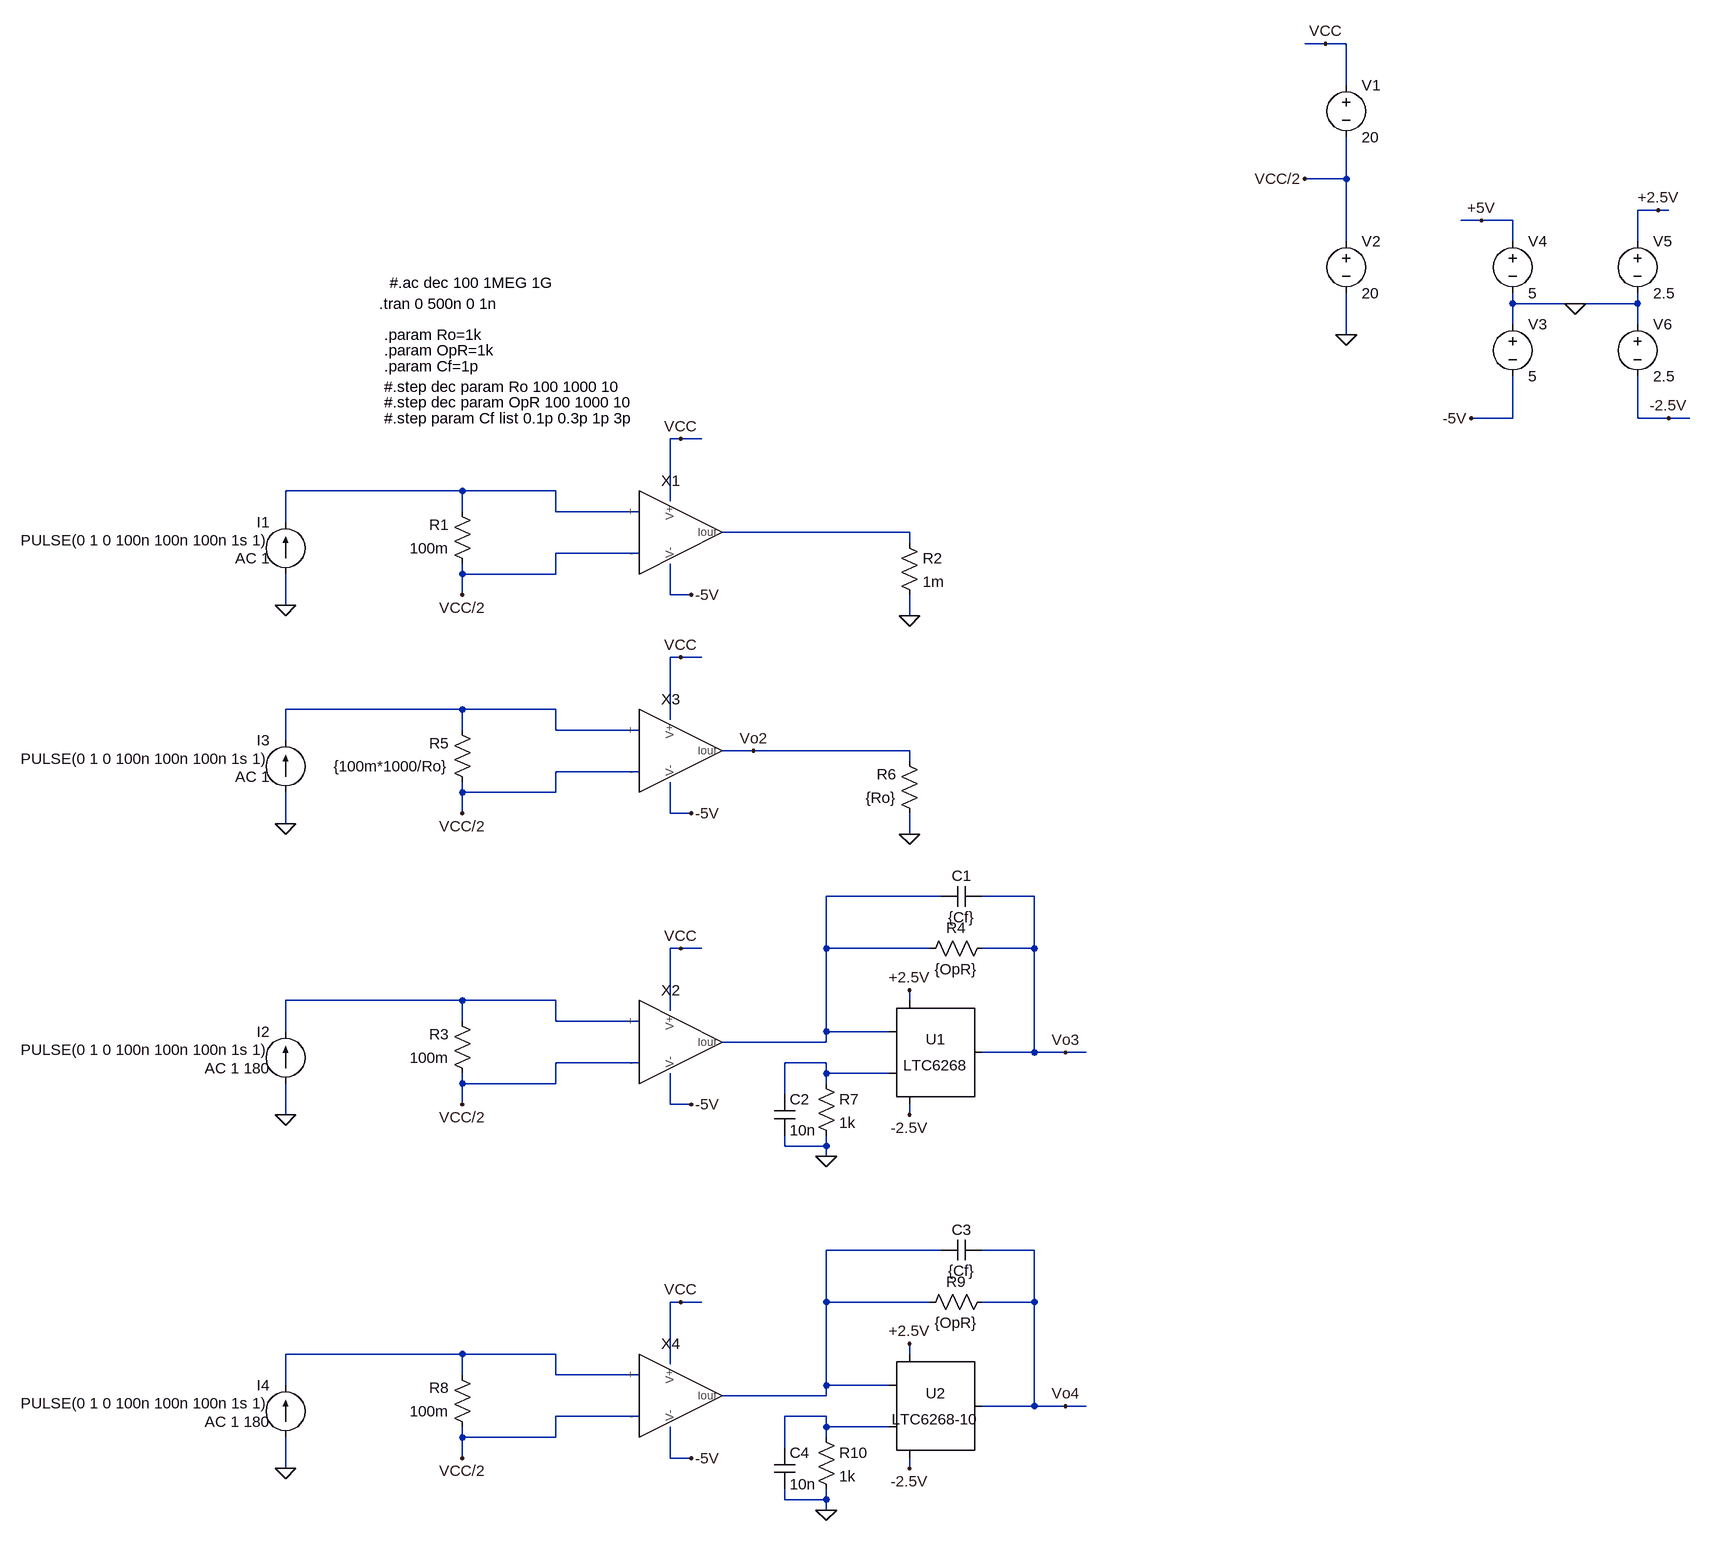
[diagram p0: schematic current-amp-test-circuit.asc]
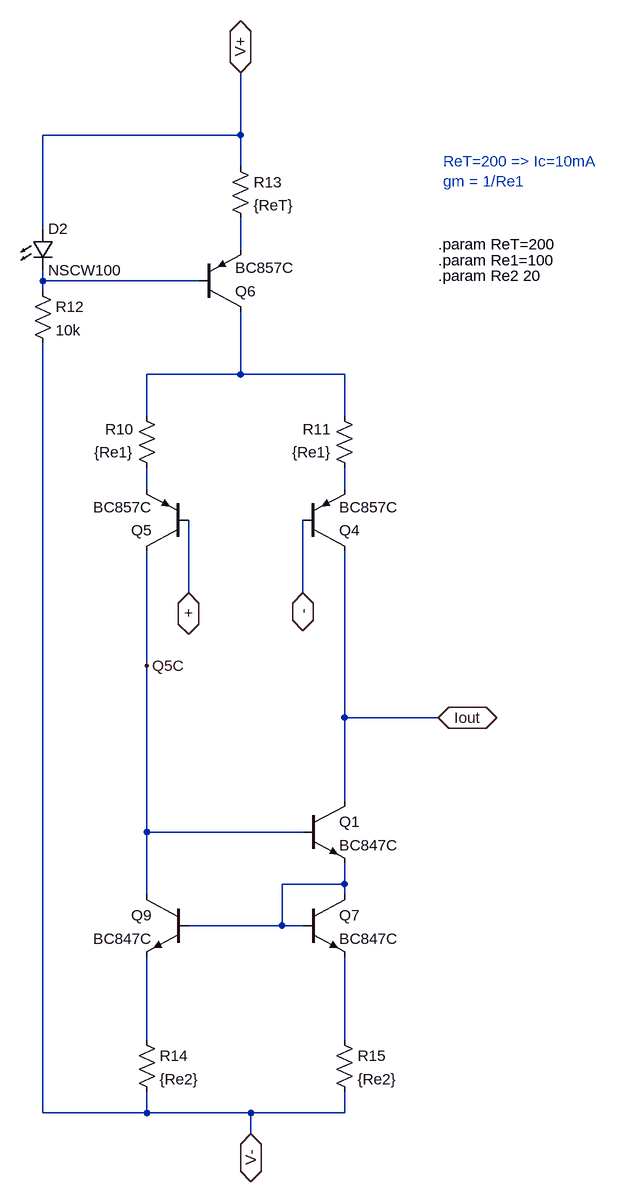
[diagram p1: sub-circuit current-amp.asc]
current-amp-test-circuit.asc, the LTspice schematic file:
Version 4
SHEET 1 1648 1724
WIRE 1072 -576 1040 -576
WIRE 1104 -576 1072 -576
WIRE 1104 -512 1104 -576
WIRE 1104 -368 1104 -432
WIRE 1104 -368 1040 -368
WIRE 1584 -320 1552 -320
WIRE 1600 -320 1584 -320
WIRE 1312 -304 1280 -304
WIRE 1360 -304 1312 -304
WIRE 1104 -272 1104 -368
WIRE 1360 -272 1360 -304
WIRE 1552 -272 1552 -320
WIRE 1360 -176 1360 -192
WIRE 1456 -176 1360 -176
WIRE 1552 -176 1552 -192
WIRE 1552 -176 1456 -176
WIRE 1360 -144 1360 -176
WIRE 1552 -144 1552 -176
WIRE 1104 -128 1104 -192
WIRE 1360 0 1360 -64
WIRE 1360 0 1296 0
WIRE 1552 0 1552 -64
WIRE 1600 0 1552 0
WIRE 1632 0 1600 0
WIRE 80 32 64 32
WIRE 112 32 80 32
WIRE -256 112 -528 112
WIRE -112 112 -256 112
WIRE 64 128 64 32
WIRE -256 144 -256 112
WIRE -112 144 -112 112
WIRE 16 144 -112 144
WIRE -528 160 -528 112
WIRE 432 176 144 176
WIRE 432 192 432 176
WIRE 16 208 -112 208
WIRE -256 240 -256 224
WIRE -112 240 -112 208
WIRE -112 240 -256 240
WIRE -256 272 -256 240
WIRE 64 272 64 224
WIRE 96 272 64 272
WIRE -528 288 -528 240
WIRE 432 304 432 272
WIRE 80 368 64 368
WIRE 112 368 80 368
WIRE -256 448 -528 448
WIRE -112 448 -256 448
WIRE 64 464 64 368
WIRE -256 480 -256 448
WIRE -112 480 -112 448
WIRE 16 480 -112 480
WIRE -528 496 -528 448
WIRE 192 512 144 512
WIRE 432 512 192 512
WIRE 432 528 432 512
WIRE 16 544 -112 544
WIRE -256 576 -256 560
WIRE -112 576 -112 544
WIRE -112 576 -256 576
WIRE -256 608 -256 576
WIRE 64 608 64 560
WIRE 96 608 64 608
WIRE -528 624 -528 576
WIRE 432 640 432 608
WIRE 480 736 304 736
WIRE 624 736 544 736
WIRE 80 816 64 816
WIRE 112 816 80 816
WIRE 304 816 304 736
WIRE 464 816 304 816
WIRE 624 816 624 736
WIRE 624 816 544 816
WIRE -256 896 -528 896
WIRE -112 896 -256 896
WIRE 432 896 432 880
WIRE 64 912 64 816
WIRE -256 928 -256 896
WIRE -112 928 -112 896
WIRE 16 928 -112 928
WIRE -528 944 -528 896
WIRE 304 944 304 816
WIRE 400 944 304 944
WIRE 304 960 304 944
WIRE 304 960 144 960
WIRE 624 976 624 816
WIRE 624 976 544 976
WIRE 672 976 624 976
WIRE 704 976 672 976
WIRE 16 992 -112 992
WIRE 304 992 240 992
WIRE 304 1008 304 992
WIRE 400 1008 304 1008
WIRE -256 1024 -256 1008
WIRE -112 1024 -112 992
WIRE -112 1024 -256 1024
WIRE 304 1024 304 1008
WIRE 240 1040 240 992
WIRE -256 1056 -256 1024
WIRE 64 1056 64 1008
WIRE 96 1056 64 1056
WIRE -528 1072 -528 1024
WIRE 432 1072 432 1056
WIRE 240 1120 240 1104
WIRE 304 1120 304 1104
WIRE 304 1120 240 1120
WIRE 304 1136 304 1120
WIRE 480 1280 304 1280
WIRE 624 1280 544 1280
WIRE 80 1360 64 1360
WIRE 112 1360 80 1360
WIRE 304 1360 304 1280
WIRE 464 1360 304 1360
WIRE 624 1360 624 1280
WIRE 624 1360 544 1360
WIRE -256 1440 -528 1440
WIRE -112 1440 -256 1440
WIRE 432 1440 432 1424
WIRE 64 1456 64 1360
WIRE -256 1472 -256 1440
WIRE -112 1472 -112 1440
WIRE 16 1472 -112 1472
WIRE -528 1488 -528 1440
WIRE 304 1488 304 1360
WIRE 400 1488 304 1488
WIRE 304 1504 304 1488
WIRE 304 1504 144 1504
WIRE 624 1520 624 1360
WIRE 624 1520 544 1520
WIRE 672 1520 624 1520
WIRE 704 1520 672 1520
WIRE 16 1536 -112 1536
WIRE 304 1536 240 1536
WIRE 304 1552 304 1536
WIRE 400 1552 304 1552
WIRE -256 1568 -256 1552
WIRE -112 1568 -112 1536
WIRE -112 1568 -256 1568
WIRE 304 1568 304 1552
WIRE 240 1584 240 1536
WIRE -256 1600 -256 1568
WIRE 64 1600 64 1552
WIRE 96 1600 64 1600
WIRE -528 1616 -528 1568
WIRE 432 1616 432 1600
WIRE 240 1664 240 1648
WIRE 304 1664 304 1648
WIRE 304 1664 240 1664
WIRE 304 1680 304 1664
FLAG 1104 -128 0
FLAG -528 288 0
FLAG 1072 -576 VCC
FLAG 1040 -368 VCC/2
FLAG 1296 0 -5V
FLAG 96 272 -5V
FLAG 80 32 VCC
FLAG 432 304 0
FLAG -256 272 VCC/2
FLAG -528 1072 0
FLAG 96 1056 -5V
FLAG 80 816 VCC
FLAG -256 1056 VCC/2
FLAG 1456 -176 0
FLAG 1312 -304 +5V
FLAG -528 624 0
FLAG 192 512 Vo2
FLAG 96 608 -5V
FLAG 80 368 VCC
FLAG 432 640 0
FLAG -256 608 VCC/2
FLAG 304 1136 0
FLAG 672 976 Vo3
FLAG 1584 -320 +2.5V
FLAG 1600 0 -2.5V
FLAG 432 880 +2.5V
FLAG 432 1072 -2.5V
FLAG -528 1616 0
FLAG 96 1600 -5V
FLAG 80 1360 VCC
FLAG -256 1600 VCC/2
FLAG 304 1680 0
FLAG 672 1520 Vo4
FLAG 432 1424 +2.5V
FLAG 432 1616 -2.5V
DATAFLAG 304 176 ""
DATAFLAG -448 112 ""
DATAFLAG -448 896 ""
DATAFLAG 304 512 ""
DATAFLAG -448 448 ""
DATAFLAG 640 976 ""
DATAFLAG -448 1440 ""
SYMBOL current-amp 64 192 R0
WINDOW 39 1 -52 Left 2
SYMATTR InstName X1
SYMBOL res -240 240 R180
WINDOW 0 36 76 Left 2
WINDOW 3 36 40 Left 2
SYMATTR InstName R1
SYMATTR Value 100m
SYMBOL res 416 176 R0
SYMATTR InstName R2
SYMATTR Value 1m
SYMBOL voltage 1104 -528 R0
WINDOW 123 0 0 Left 0
WINDOW 39 0 0 Left 0
SYMATTR InstName V1
SYMATTR Value 20
SYMBOL voltage 1104 -288 R0
WINDOW 123 0 0 Left 0
WINDOW 39 0 0 Left 0
SYMATTR InstName V2
SYMATTR Value 20
SYMBOL voltage 1360 -160 R0
WINDOW 123 0 0 Left 0
WINDOW 39 0 0 Left 0
SYMATTR InstName V3
SYMATTR Value 5
SYMBOL current -528 240 R180
WINDOW 0 24 80 Left 2
WINDOW 3 24 52 Left 2
WINDOW 123 24 24 Left 2
WINDOW 39 0 0 Left 0
SYMATTR InstName I1
SYMATTR Value PULSE(0 1 0 100n 100n 100n 1s 1)
SYMATTR Value2 AC 1
SYMBOL current-amp 64 976 R0
SYMATTR InstName X2
SYMBOL res -240 1024 R180
WINDOW 0 36 76 Left 2
WINDOW 3 36 40 Left 2
SYMATTR InstName R3
SYMATTR Value 100m
SYMBOL current -528 1024 R180
WINDOW 0 24 80 Left 2
WINDOW 3 24 52 Left 2
WINDOW 123 24 24 Left 2
WINDOW 39 0 0 Left 0
SYMATTR InstName I2
SYMATTR Value PULSE(0 1 0 100n 100n 100n 1s 1)
SYMATTR Value2 AC 1 180
SYMBOL voltage 1360 -288 R0
WINDOW 123 0 0 Left 0
WINDOW 39 0 0 Left 0
SYMATTR InstName V4
SYMATTR Value 5
SYMBOL current-amp 64 528 R0
SYMATTR InstName X3
SYMBOL res -240 576 R180
WINDOW 0 36 76 Left 2
WINDOW 3 36 40 Left 2
SYMATTR InstName R5
SYMATTR Value {100m*1000/Ro}
SYMBOL res 448 624 R180
WINDOW 0 36 76 Left 2
WINDOW 3 36 40 Left 2
SYMATTR InstName R6
SYMATTR Value {Ro}
SYMBOL current -528 576 R180
WINDOW 0 24 80 Left 2
WINDOW 3 24 52 Left 2
WINDOW 123 24 24 Left 2
WINDOW 39 0 0 Left 0
SYMATTR InstName I3
SYMATTR Value PULSE(0 1 0 100n 100n 100n 1s 1)
SYMATTR Value2 AC 1
SYMBOL res 560 800 R90
WINDOW 0 0 56 VBottom 2
WINDOW 3 32 56 VTop 2
SYMATTR InstName R4
SYMATTR Value {OpR}
SYMBOL res 288 1008 R0
SYMATTR InstName R7
SYMATTR Value 1k
SYMBOL cap 544 720 R90
WINDOW 0 0 32 VBottom 2
WINDOW 3 32 32 VTop 2
SYMATTR InstName C1
SYMATTR Value {Cf}
SYMBOL cap 224 1040 R0
SYMATTR InstName C2
SYMATTR Value 10n
SYMBOL voltage 1552 -288 R0
WINDOW 123 0 0 Left 0
WINDOW 39 0 0 Left 0
SYMATTR InstName V5
SYMATTR Value 2.5
SYMBOL voltage 1552 -160 R0
WINDOW 123 0 0 Left 0
WINDOW 39 0 0 Left 0
SYMATTR InstName V6
SYMATTR Value 2.5
SYMBOL OpAmps\\LTC6268 432 976 R0
SYMATTR InstName U1
SYMBOL current-amp 64 1520 R0
SYMATTR InstName X4
SYMBOL res -240 1568 R180
WINDOW 0 36 76 Left 2
WINDOW 3 36 40 Left 2
SYMATTR InstName R8
SYMATTR Value 100m
SYMBOL current -528 1568 R180
WINDOW 0 24 80 Left 2
WINDOW 3 24 52 Left 2
WINDOW 123 24 24 Left 2
WINDOW 39 0 0 Left 0
SYMATTR InstName I4
SYMATTR Value PULSE(0 1 0 100n 100n 100n 1s 1)
SYMATTR Value2 AC 1 180
SYMBOL res 560 1344 R90
WINDOW 0 0 56 VBottom 2
WINDOW 3 32 56 VTop 2
SYMATTR InstName R9
SYMATTR Value {OpR}
SYMBOL res 288 1552 R0
SYMATTR InstName R10
SYMATTR Value 1k
SYMBOL cap 544 1264 R90
WINDOW 0 0 32 VBottom 2
WINDOW 3 32 32 VTop 2
SYMATTR InstName C3
SYMATTR Value {Cf}
SYMBOL cap 224 1584 R0
SYMATTR InstName C4
SYMATTR Value 10n
SYMBOL OpAmps\\LTC6268-10 432 1520 R0
SYMATTR InstName U2
TEXT -384 -176 Left 2 !.tran 0 500n 0 1n
TEXT -368 -208 Left 2 !#.ac dec 100 1MEG 1G
TEXT -376 -128 Left 2 !.param Ro=1k
TEXT -376 -48 Left 2 !#.step dec param Ro 100 1000 10
TEXT -376 -104 Left 2 !.param OpR=1k
TEXT -376 -24 Left 2 !#.step dec param OpR 100 1000 10
TEXT -376 -80 Left 2 !.param Cf=1p
TEXT -376 0 Left 2 !#.step param Cf list 0.1p 0.3p 1p 3p

current-amp.asc, the sub-circuit schematic file:
Version 4
SHEET 1 1708 680
WIRE -1216 -1312 -1216 -1408
WIRE -1216 -1312 -1520 -1312
WIRE -1216 -1264 -1216 -1312
WIRE -1520 -1168 -1520 -1312
WIRE -1216 -1136 -1216 -1184
WIRE -1520 -1088 -1520 -1104
WIRE -1280 -1088 -1520 -1088
WIRE -1520 -1072 -1520 -1088
WIRE -1216 -944 -1216 -1040
WIRE -1216 -944 -1360 -944
WIRE -1056 -944 -1216 -944
WIRE -1360 -880 -1360 -944
WIRE -1056 -880 -1056 -944
WIRE -1360 -768 -1360 -800
WIRE -1056 -768 -1056 -800
WIRE -1296 -608 -1296 -720
WIRE -1120 -608 -1120 -720
WIRE -1360 -496 -1360 -672
WIRE -1056 -416 -1056 -672
WIRE -912 -416 -1056 -416
WIRE -1056 -288 -1056 -416
WIRE -1360 -240 -1360 -496
WIRE -1120 -240 -1360 -240
WIRE -1056 -160 -1056 -192
WIRE -1056 -160 -1152 -160
WIRE -1360 -144 -1360 -240
WIRE -1056 -144 -1056 -160
WIRE -1152 -96 -1152 -160
WIRE -1152 -96 -1296 -96
WIRE -1120 -96 -1152 -96
WIRE -1360 80 -1360 -48
WIRE -1056 80 -1056 -48
WIRE -1520 192 -1520 -992
WIRE -1360 192 -1360 160
WIRE -1360 192 -1520 192
WIRE -1200 192 -1360 192
WIRE -1056 192 -1056 160
WIRE -1056 192 -1200 192
WIRE -1200 224 -1200 192
FLAG -1360 -496 Q5C
FLAG -1216 -1408 V+
IOPIN -1216 -1408 BiDir
FLAG -1200 224 V-
IOPIN -1200 224 BiDir
FLAG -912 -416 Iout
IOPIN -912 -416 BiDir
FLAG -1296 -608 +
IOPIN -1296 -608 BiDir
FLAG -1120 -608 -
IOPIN -1120 -608 BiDir
DATAFLAG -1360 -336 "Ic(Q5)"
DATAFLAG -1056 -496 "Ic(Q4)"
DATAFLAG -1360 -784 "I(R10)"
DATAFLAG -1056 -160 ""
DATAFLAG -1168 192 ""
SYMBOL pnp -1120 -672 M180
SYMATTR InstName Q4
SYMATTR Value BC857C
SYMBOL pnp -1296 -672 R180
SYMATTR InstName Q5
SYMATTR Value BC857C
SYMBOL res -1344 -784 R180
WINDOW 0 36 76 Left 2
WINDOW 3 36 40 Left 2
SYMATTR InstName R10
SYMATTR Value {Re1}
SYMBOL res -1040 -784 R180
WINDOW 0 36 76 Left 2
WINDOW 3 36 40 Left 2
SYMATTR InstName R11
SYMATTR Value {Re1}
SYMBOL pnp -1280 -1040 M180
SYMATTR InstName Q6
SYMATTR Value BC857C
SYMBOL LED -1536 -1168 R0
SYMATTR InstName D2
SYMATTR Value NSCW100
SYMATTR Description Diode
SYMATTR Type diode
SYMBOL res -1536 -1088 R0
SYMATTR InstName R12
SYMATTR Value 10k
SYMBOL res -1232 -1280 R0
SYMATTR InstName R13
SYMATTR Value {ReT}
SYMBOL res -1376 64 R0
SYMATTR InstName R14
SYMATTR Value {Re2}
SYMBOL res -1072 64 R0
SYMATTR InstName R15
SYMATTR Value {Re2}
SYMBOL npn -1120 -144 R0
SYMATTR InstName Q7
SYMATTR Value BC847C
SYMBOL npn -1296 -144 M0
SYMATTR InstName Q9
SYMATTR Value BC847C
SYMBOL npn -1120 -288 R0
SYMATTR InstName Q1
SYMATTR Value BC847C
TEXT -912 -1144 Left 2 !.param ReT=200
TEXT -912 -1120 Left 2 !.param Re1=100
TEXT -912 -1096 Left 2 !.param Re2 20
TEXT -904 -1272 Left 2 ;ReT=200 => Ic=10mA\ngm = 1/Re1

The netlist it stands for:
* current-amp-test-circuit.asc
XX1 N001 VCC/2 N002 VCC -5V current-amp
R1 VCC/2 N001 100m
R2 N002 0 1m
V1 VCC VCC/2 20
V2 VCC/2 0 20
V3 0 -5V 5
I1 0 N001 PULSE(0 1 0 100n 100n 100n 1s 1) AC 1
XX2 N005 VCC/2 N004 VCC -5V current-amp
R3 VCC/2 N005 100m
I2 0 N005 PULSE(0 1 0 100n 100n 100n 1s 1) AC 1 180
V4 +5V 0 5
XX3 N003 VCC/2 Vo2 VCC -5V current-amp
R5 VCC/2 N003 {100m*1000/Ro}
R6 0 Vo2 {Ro}
I3 0 N003 PULSE(0 1 0 100n 100n 100n 1s 1) AC 1
R4 Vo3 N004 {OpR}
R7 N006 0 1k
C1 Vo3 N004 {Cf}
C2 N006 0 10n
V5 +2.5V 0 2.5
V6 0 -2.5V 2.5
XU1 N006 N004 Vo3 +2.5V -2.5V NC_01 LTC6268
XX4 N008 VCC/2 N007 VCC -5V current-amp
R8 VCC/2 N008 100m
I4 0 N008 PULSE(0 1 0 100n 100n 100n 1s 1) AC 1 180
R9 Vo4 N007 {OpR}
R10 N009 0 1k
C3 Vo4 N007 {Cf}
C4 N009 0 10n
XU2 N009 N007 Vo4 +2.5V -2.5V NC_02 LTC6268-10

* block symbol definitions
.subckt current-amp + - Iout V+ V-
Q4 Iout - N005 0 BC857C
Q5 Q5C + N004 0 BC857C
R10 N004 N003 {Re1}
R11 N005 N003 {Re1}
Q6 N003 N002 N001 0 BC857C
D2 V+ N002 NSCW100
R12 N002 V- 10k
R13 V+ N001 {ReT}
R14 N007 V- {Re2}
R15 N008 V- {Re2}
Q7 N006 N006 N008 0 BC847C
Q9 Q5C N006 N007 0 BC847C
Q1 Iout Q5C N006 0 BC847C
.param ReT=200
.param Re1=100
.param Re2 20
* ReT=200 => Ic=10mA
* gm = 1/Re1
.ends current-amp

.model D D
.lib standard.dio
.model NPN NPN
.model PNP PNP
.lib standard.bjt
.tran 0 500n 0 1n
#.ac dec 100 1MEG 1G
.param Ro=1k
#.step dec param Ro 100 1000 10
.param OpR=1k
#.step dec param OpR 100 1000 10
.param Cf=1p
#.step param Cf list 0.1p 0.3p 1p 3p
.lib LTC2.lib
.backanno
.end